# EAGLE design gsmSwitch_REV_C (EAGLE 5.07)

## Sheet 1 of 4
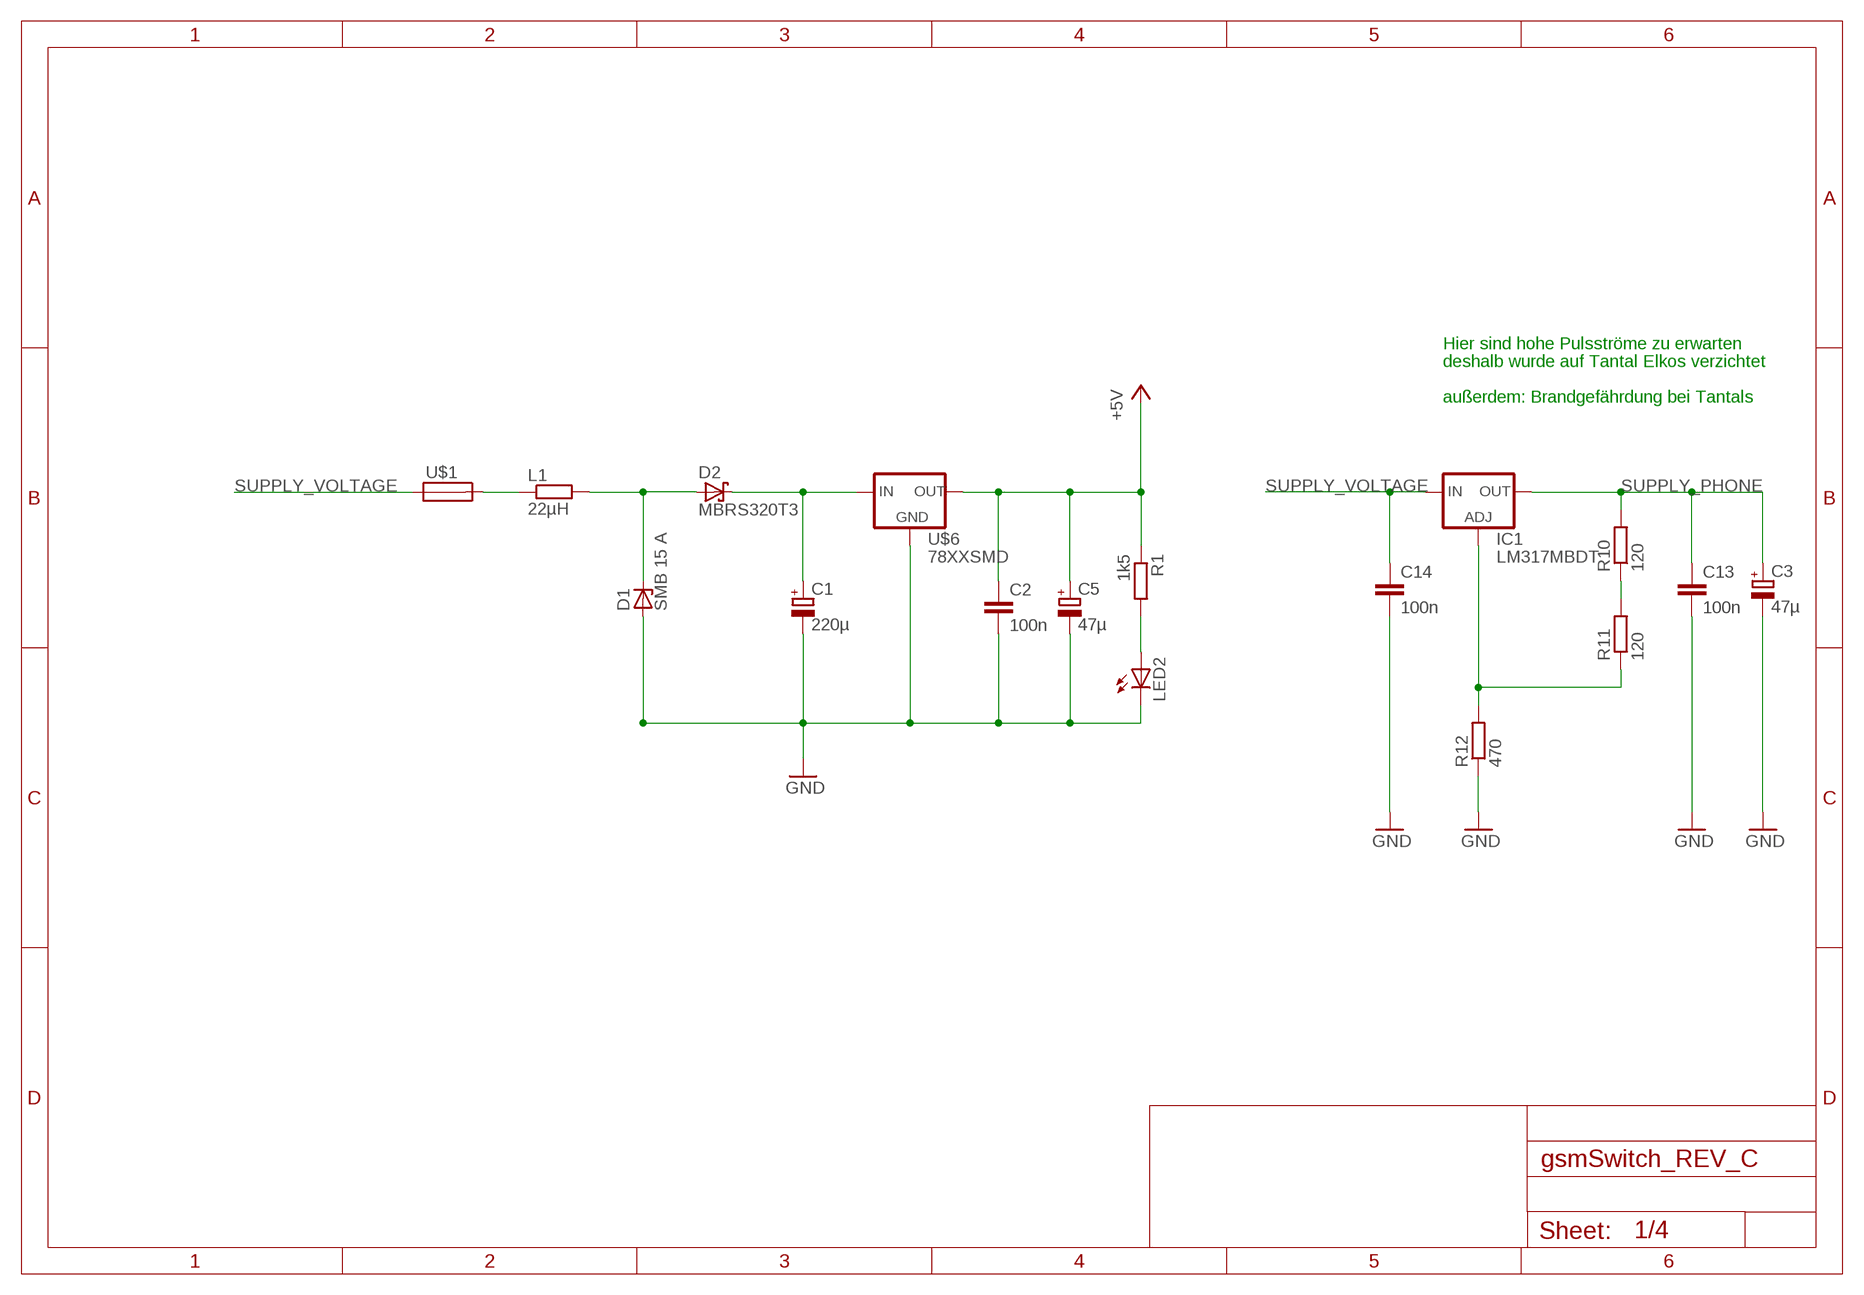
[diagram p0: schematic, sheet 1]

### Parts
C1  220µ  CPOL-EUE5-10.5  [E5-10,5]
C2  100n  C-EUC0603  [C0603]
C3  47µ  CPOL-EUE2-4  [E2-4]
C5  47µ  CPOL-EUE2-4  [E2-4]
C13  100n  C-EUC0603  [C0603]
C14  100n  C-EUC0603  [C0603]
D1  SMB 15 A  ZENER-DIODESMB  [SMB]
D2  MBRS320T3  [SMC]
IC1  LM317MBDT  [DPACK]
L1  22µH  R-EU_R1206  [R1206]
LED2  LEDCHIPLED_1206  [CHIPLED_1206]
R1  1k5  R-EU_R0603  [R0603]
R10  120  R-EU_R0603  [R0603]
R11  120  R-EU_R0603  [R0603]
R12  470  R-EU_R0603  [R0603]
U$1  TP-154  [TP-154]
U$6  78XXSMD  [DPACK]

### Nets
+5V: C2.1 C5.+ R1.1 U$6.3(OUT) ; also sheet 2,3,4
GND: C1.- C2.2 C3.- C5.- C13.2 C14.2 D1.A LED2.C R12.1 U$6.4(GND) ; also sheet 2,3,4
N$1: C1.+ D2.C U$6.1(IN)
N$6: IC1.1(ADJ) R11.1 R12.2
N$15: R10.1 R11.2
N$17: L1.1 U$1.P$3
N$23: D1.C D2.A L1.2
N$25: LED2.A R1.2
SUPPLY_PHONE: C3.+ C13.1 IC1.4(OUT) R10.2 ; also sheet 3
SUPPLY_VOLTAGE: C14.1 IC1.3(IN) U$1.P$2 ; also sheet 3

### Notes on the sheet
- Hier sind hohe Pulsströme zu erwarten
- deshalb wurde auf Tantal Elkos verzichtet
- außerdem: Brandgefährdung bei Tantals

## Sheet 2 of 4
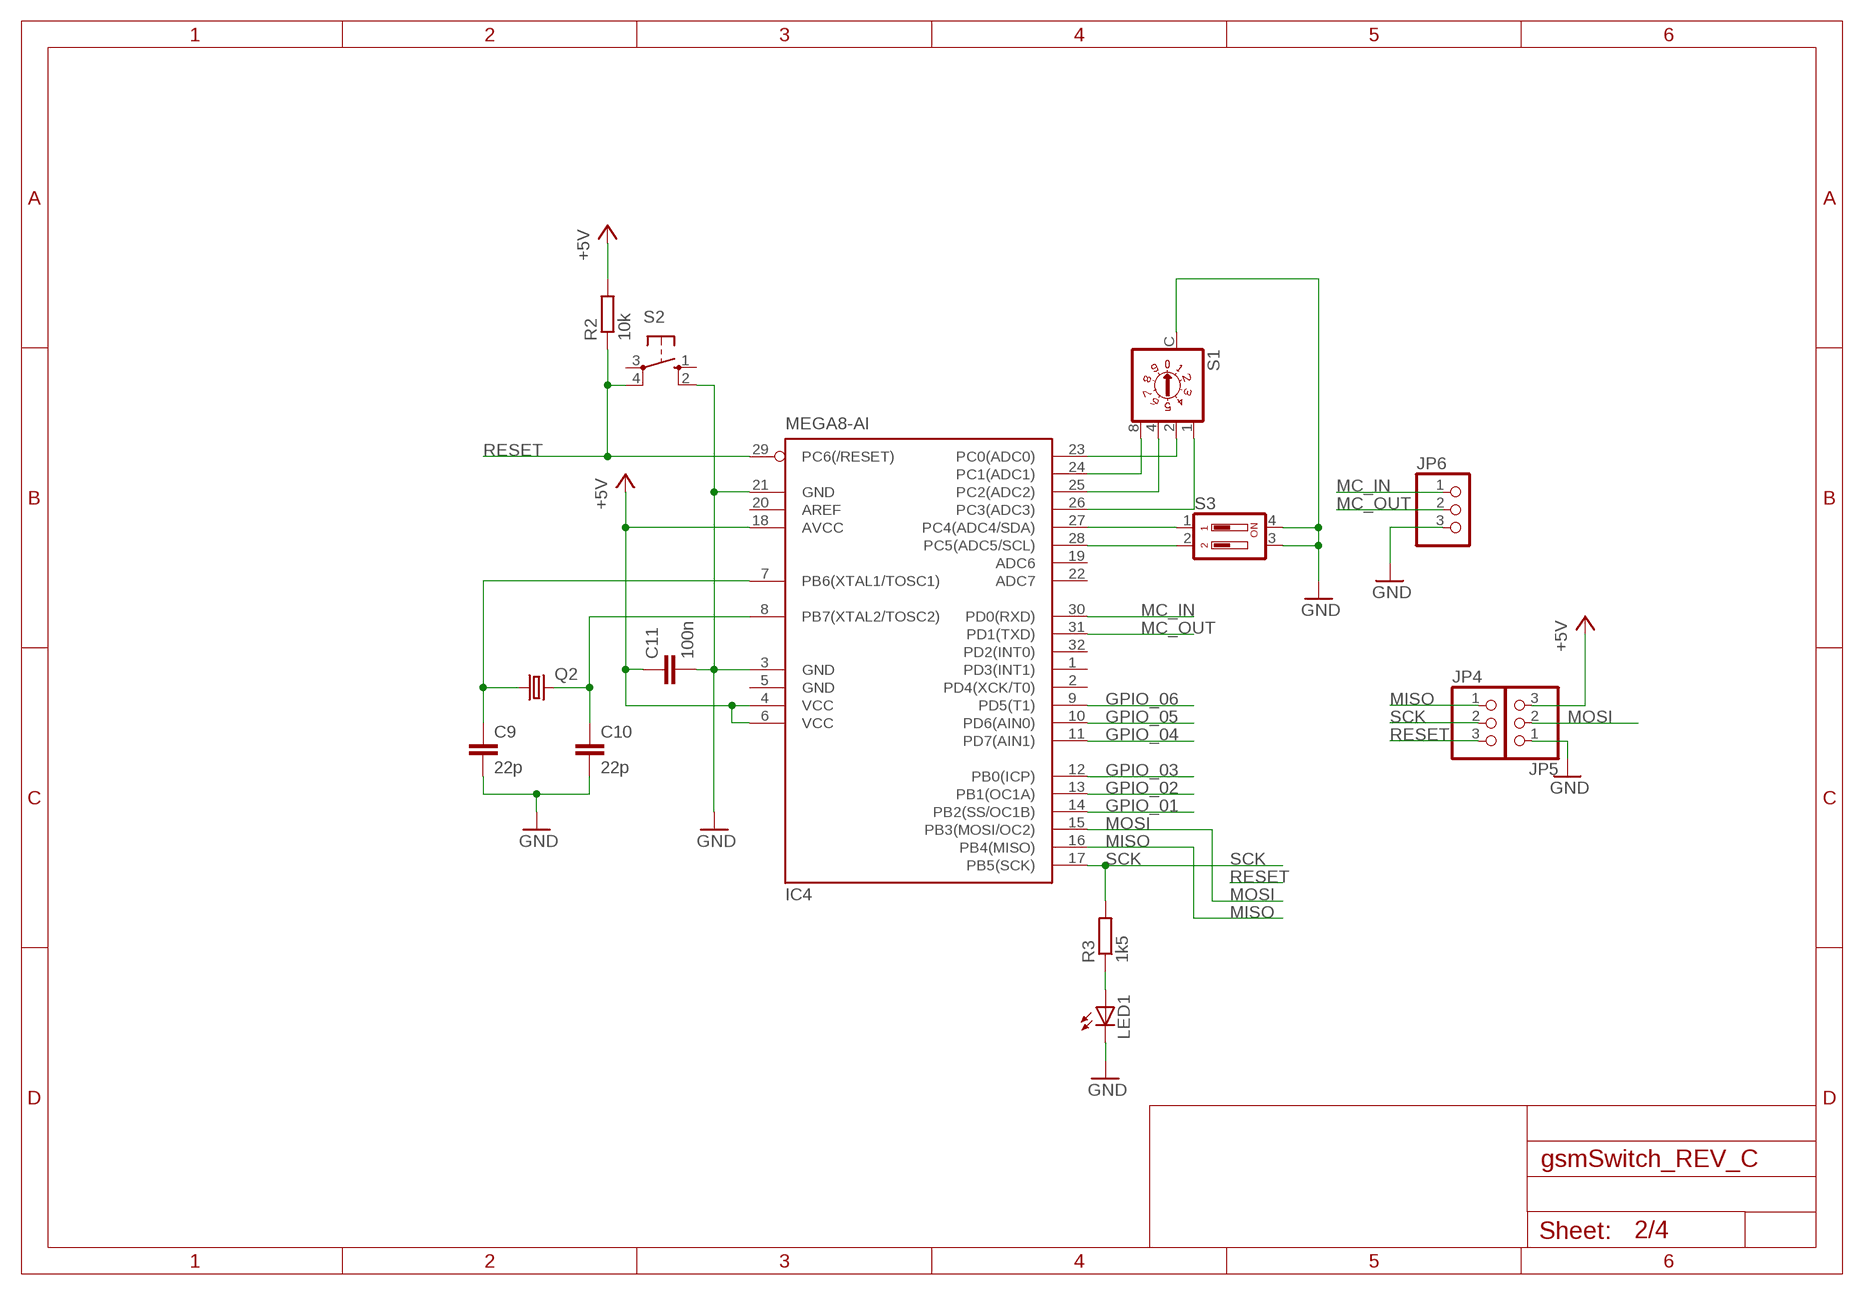
[diagram p1: schematic, sheet 2]

### Parts
C9  22p  C-EUC0603  [C0603]
C10  22p  C-EUC0603  [C0603]
C11  100n  C-EUC0603  [C0603]
IC4  MEGA8-AI  [TQFP32-08]
JP4  PINHD-1X03_2.54-SMD-90°  [1X03SMD/90]
JP5  PINHD-1X03_2.54-SMD-90°  [1X03SMD/90]
JP6  PINHD-1X3  [1X03]
LED1  LEDCHIPLED_1206  [CHIPLED_1206]
Q2  CRYSTALHC49UP  [HC49UP]
R2  10k  R-EU_R0603  [R0603]
R3  1k5  R-EU_R0603  [R0603]
S1  P101  [P101]
S2  10-XX  [B3F-10XX]
S3  DIP02YL  [DIP02YL]

### Nets
+5V: C11.1 IC4.4(VCC) IC4.6(VCC) IC4.18(AVCC) JP5.3 R2.2 ; also sheet 1,3,4
GND: C9.2 C10.2 C11.2 IC4.3(GND) IC4.21(GND) JP5.1 JP6.3 LED1.C S1.C S2.2(S1) S3.3 S3.4 ; also sheet 1,3,4
GPIO_01: IC4.14(PB2(SS/OC1B)) ; also sheet 3
GPIO_02: IC4.13(PB1(OC1A)) ; also sheet 3
GPIO_03: IC4.12(PB0(ICP)) ; also sheet 3
GPIO_04: IC4.11(PD7(AIN1)) ; also sheet 3
GPIO_05: IC4.10(PD6(AIN0)) ; also sheet 3
GPIO_06: IC4.9(PD5(T1)) ; also sheet 3
MC_IN: IC4.30(PD0(RXD)) JP6.1 ; also sheet 4
MC_OUT: IC4.31(PD1(TXD)) JP6.2 ; also sheet 4
MISO: IC4.16(PB4(MISO)) JP4.1
MOSI: IC4.15(PB3(MOSI/OC2)) JP5.2
N$8: IC4.27(PC4(ADC4/SDA)) S3.1
N$11: IC4.28(PC5(ADC5/SCL)) S3.2
N$34: LED1.A R3.1
N$41: C9.1 IC4.7(PB6(XTAL1/TOSC1)) Q2.1
N$44: C10.1 IC4.8(PB7(XTAL2/TOSC2)) Q2.2
N$45: IC4.23(PC0(ADC0)) S1.2
N$46: IC4.24(PC1(ADC1)) S1.8
N$47: IC4.25(PC2(ADC2)) S1.4
N$48: IC4.26(PC3(ADC3)) S1.1
RESET: IC4.29(PC6(/RESET)) JP4.3 R2.1 S2.4(P1)
SCK: IC4.17(PB5(SCK)) JP4.2 R3.2
Unconnected: IC4.1(PD3(INT1)) IC4.2(PD4(XCK/T0)) IC4.19(ADC6) IC4.20(AREF) IC4.22(ADC7) IC4.32(PD2(INT0)) S2.1(S) S2.3(P)

## Sheet 3 of 4
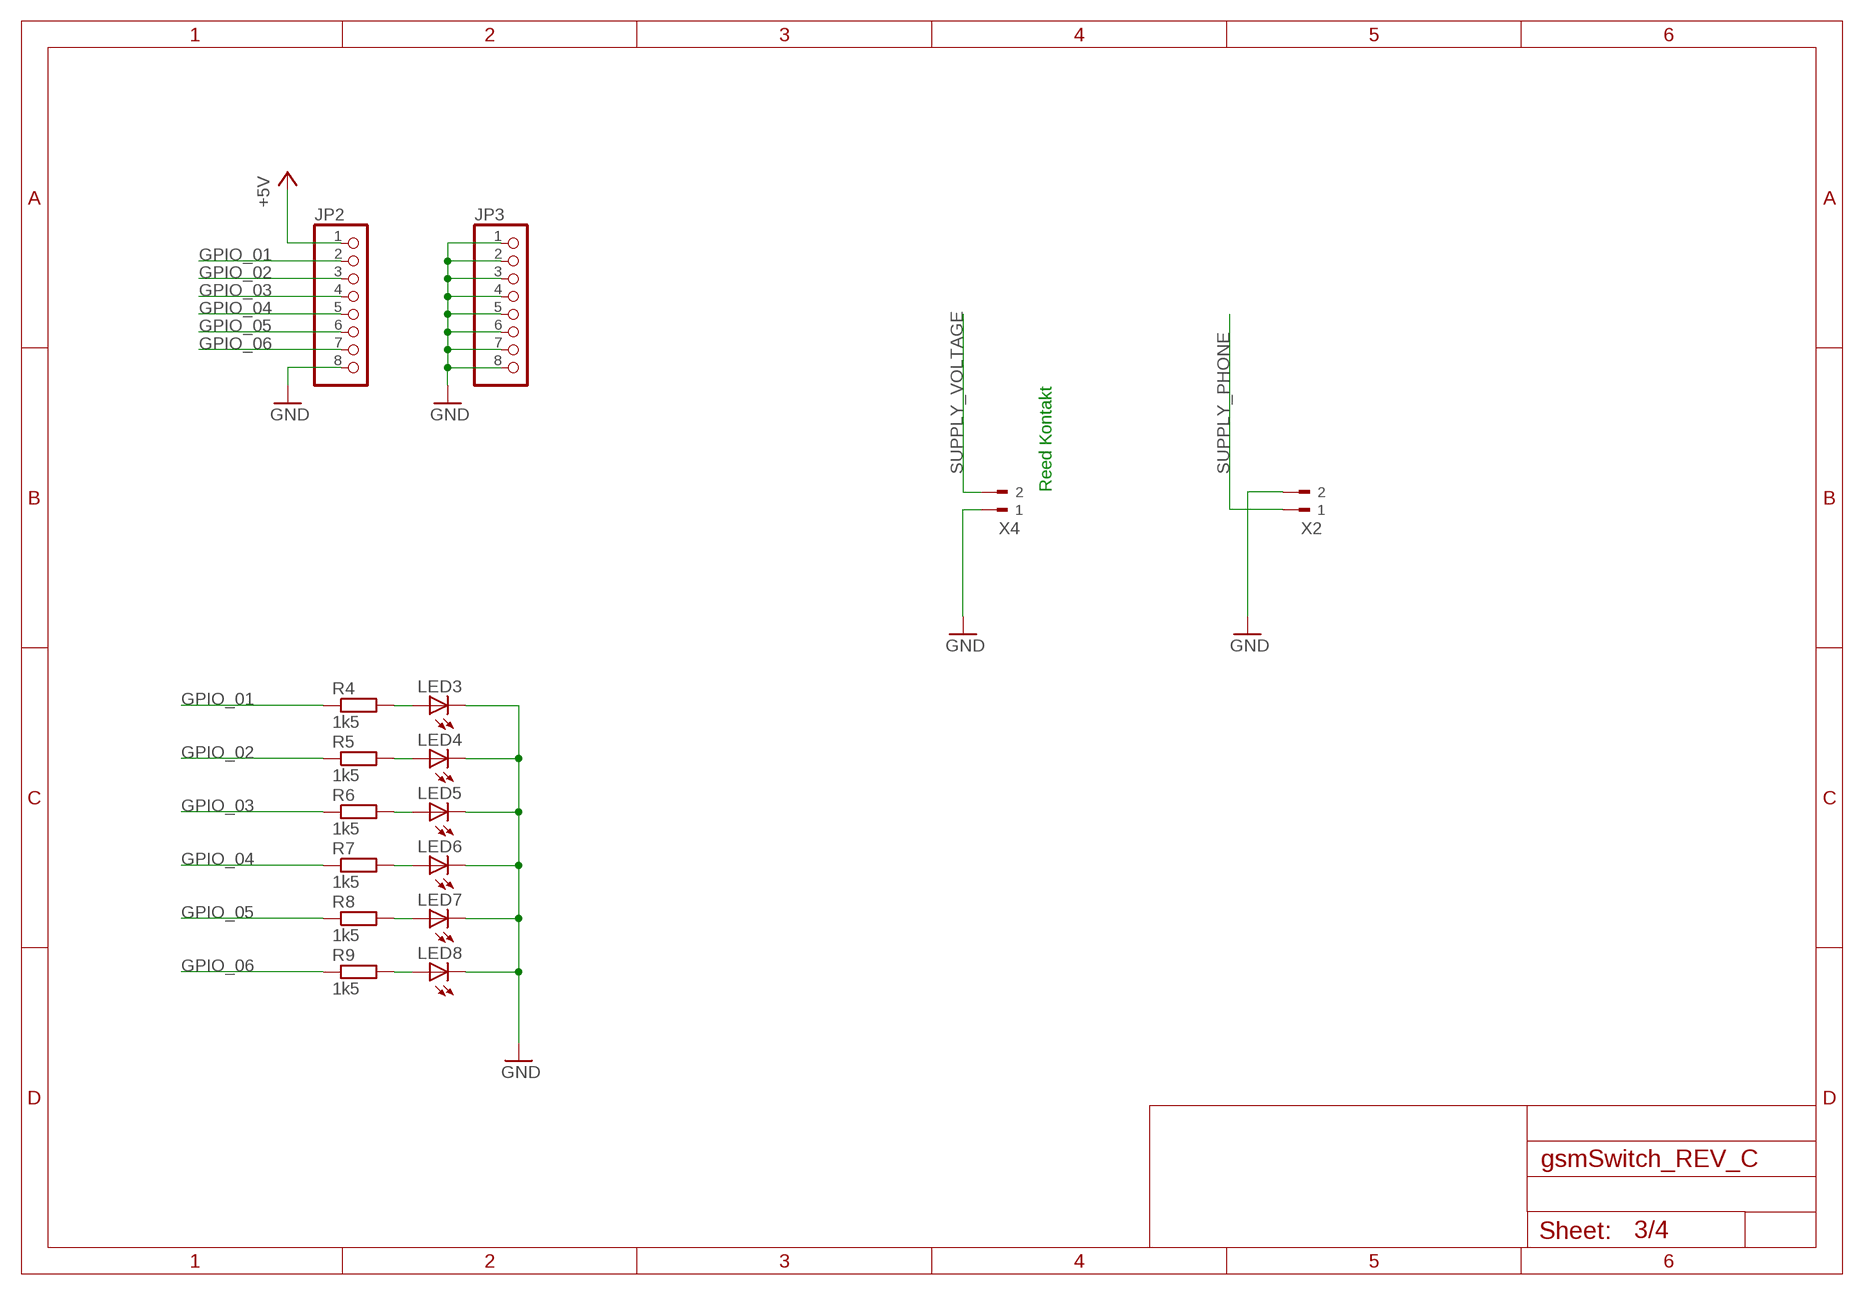
[diagram p2: schematic, sheet 3]

### Parts
JP2  PINHD-1X08_2.54-SMD-90°  [1X08SMD/90]
JP3  PINHD-1X08_2.54-SMD-90°  [1X08SMD/90]
LED3  LEDCHIP-LED0603  [CHIP-LED0603]
LED4  LEDCHIP-LED0603  [CHIP-LED0603]
LED5  LEDCHIP-LED0603  [CHIP-LED0603]
LED6  LEDCHIP-LED0603  [CHIP-LED0603]
LED7  LEDCHIP-LED0603  [CHIP-LED0603]
LED8  LEDCHIP-LED0603  [CHIP-LED0603]
R4  1k5  R-EU_R0603  [R0603]
R5  1k5  R-EU_R0603  [R0603]
R6  1k5  R-EU_R0603  [R0603]
R7  1k5  R-EU_R0603  [R0603]
R8  1k5  R-EU_R0603  [R0603]
R9  1k5  R-EU_R0603  [R0603]
X2  180-2  [180-2]
X4  180-2  [180-2]

### Nets
+5V: JP2.1 ; also sheet 1,2,4
GND: JP2.8 JP3.1 JP3.2 JP3.3 JP3.4 JP3.5 JP3.6 JP3.7 JP3.8 LED3.C LED4.C LED5.C LED6.C LED7.C LED8.C X2.2 X4.1 ; also sheet 1,2,4
GPIO_01: JP2.2 R4.1 ; also sheet 2
GPIO_02: JP2.3 R5.1 ; also sheet 2
GPIO_03: JP2.4 R6.1 ; also sheet 2
GPIO_04: JP2.5 R7.1 ; also sheet 2
GPIO_05: JP2.6 R8.1 ; also sheet 2
GPIO_06: JP2.7 R9.1 ; also sheet 2
N$2: LED8.A R9.2
N$3: LED7.A R8.2
N$4: LED6.A R7.2
N$5: LED5.A R6.2
N$7: LED4.A R5.2
N$9: LED3.A R4.2
SUPPLY_PHONE: X2.1 ; also sheet 1
SUPPLY_VOLTAGE: X4.2 ; also sheet 1

### Notes on the sheet
- Reed Kontakt

## Sheet 4 of 4
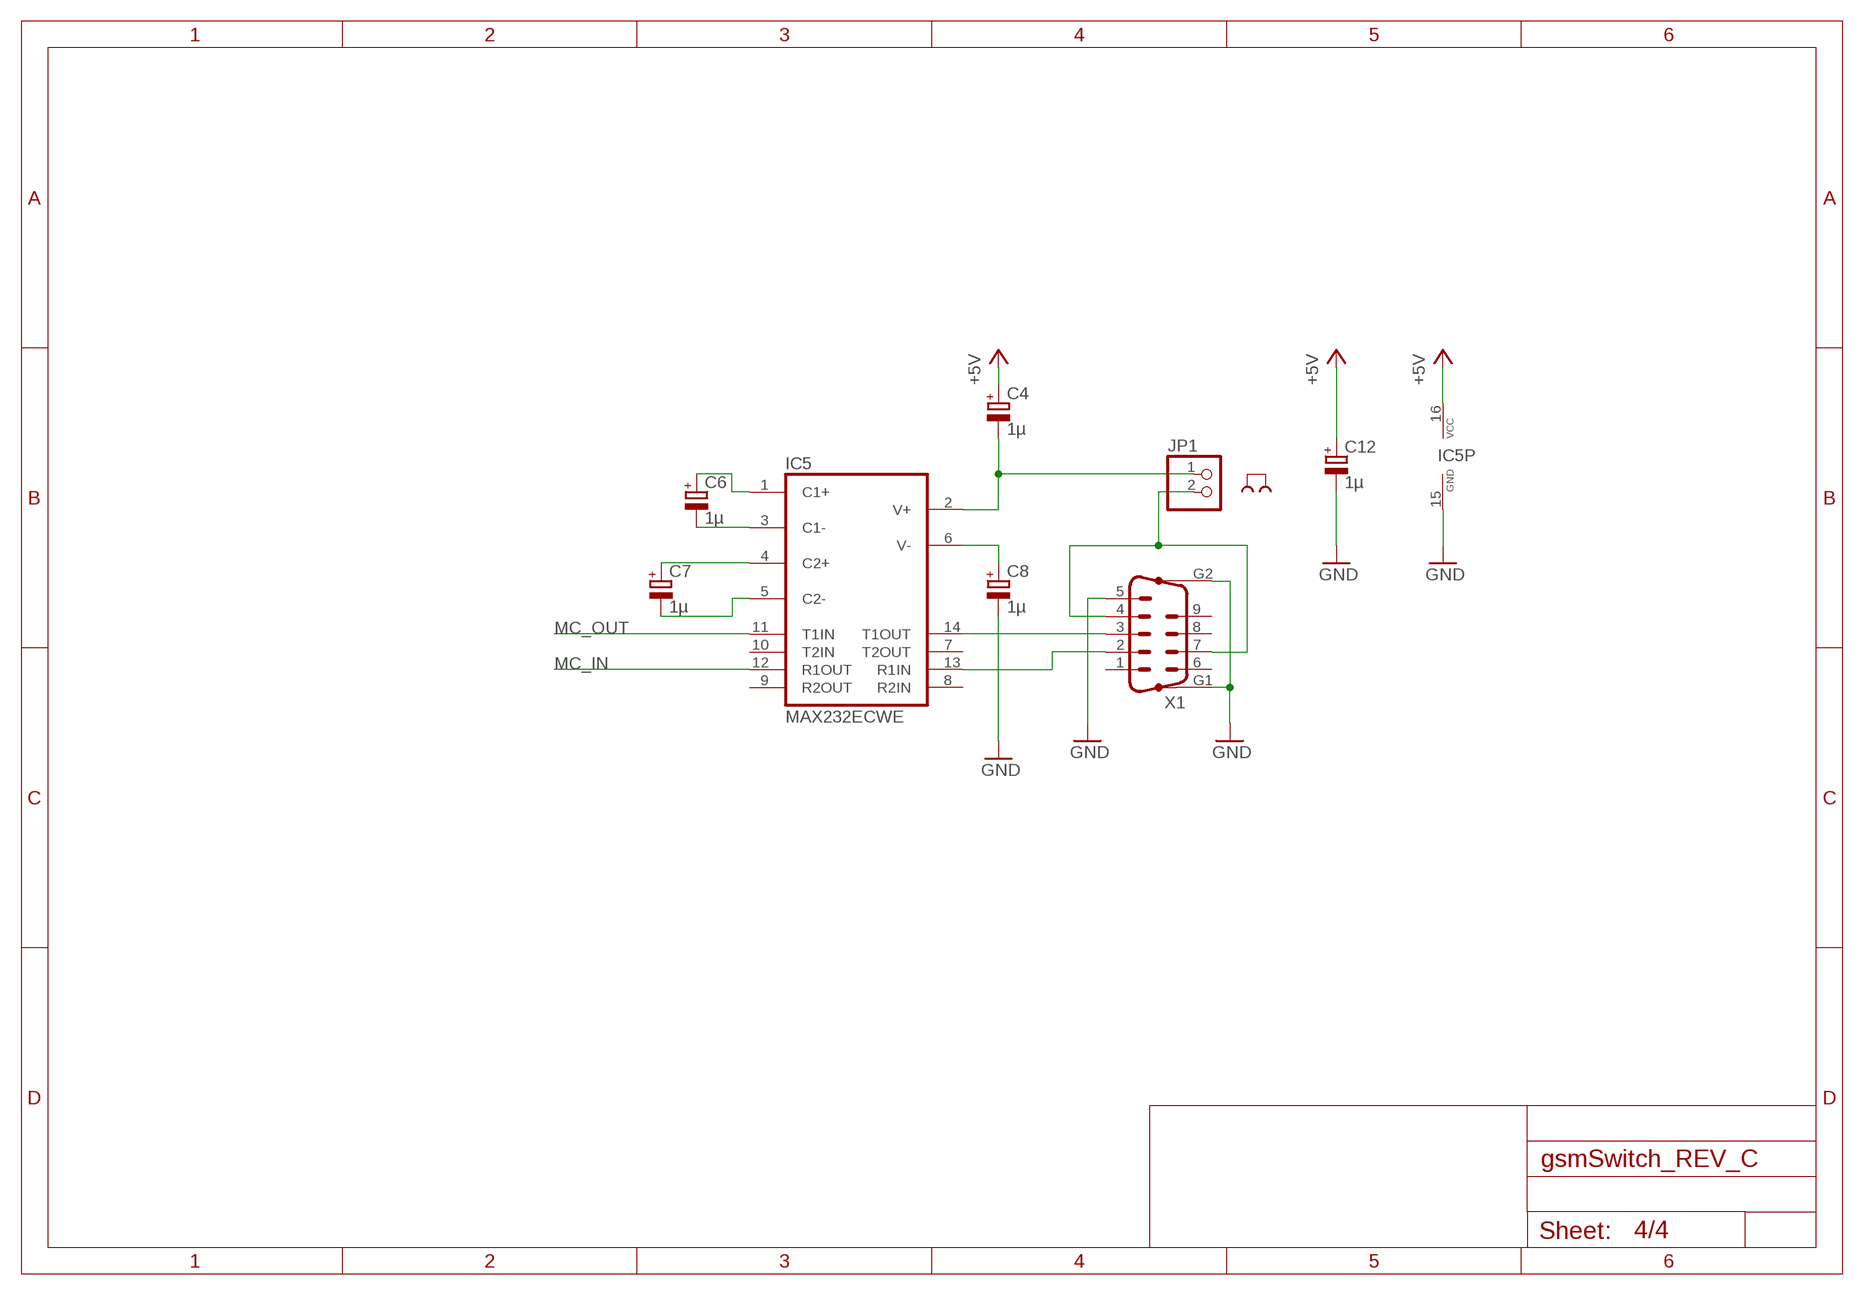
[diagram p3: schematic, sheet 4]

### Parts
C4  1µ  CPOL-EUSANYO_SMD_A5  [SANYO-OSCON_SMD_A5]
C6  1µ  CPOL-EUSANYO_SMD_A5  [SANYO-OSCON_SMD_A5]
C7  1µ  CPOL-EUSANYO_SMD_A5  [SANYO-OSCON_SMD_A5]
C8  1µ  CPOL-EUSANYO_SMD_A5  [SANYO-OSCON_SMD_A5]
C12  1µ  CPOL-EUSANYO_SMD_A5  [SANYO-OSCON_SMD_A5]
IC5  MAX232ECWE  [SO16L]
J1  JUMPER  [JUMP]
JP1  PINHD-1X2  [1X02]
X1  M09HP  [M09HP]

### Nets
+5V: C4.+ C12.+ IC5.16(VCC) ; also sheet 1,2,3
GND: C8.- C12.- IC5.15(GND) X1.5 X1.G1 X1.G2 ; also sheet 1,2,3
MC_IN: IC5.12(R1OUT) ; also sheet 2
MC_OUT: IC5.11(T1IN) ; also sheet 2
N$10: IC5.13(R1IN) X1.2
N$12: IC5.14(T1OUT) X1.3
N$13: JP1.2 X1.4 X1.7
N$16: C8.+ IC5.6(V-)
N$18: C6.+ IC5.1(C1+)
N$19: C6.- IC5.3(C1-)
N$20: C7.+ IC5.4(C2+)
N$21: C7.- IC5.5(C2-)
N$22: C4.- IC5.2(V+) JP1.1
Unconnected: IC5.7(T2OUT) IC5.8(R2IN) IC5.9(R2OUT) IC5.10(T2IN) X1.1 X1.6 X1.8 X1.9

## Power pins joined to a net without a drawn wire
GND: IC4.5(GND)

## Library data of the parts
C1 C3-C8 C12 = rcl:CPOL-EU: POLARIZED CAPACITOR, European symbol
C2 C9-C11 C13 C14 = rcl:C-EU: CAPACITOR, European symbol
D1 = diode:ZENER-DIODE: Z-Diode
D2 = diode:MBRS3*0T3: SCHOTTKY BARRIER RECTIFIER 3.0 AMPERES 20, 30, 40 VOLT Source: MBRS340T3-D.pdf
IC1 = v-reg:LM317?*: 500 mA Adjustable Output Positive Voltage Regulator Source: http://www.onsemi.co.jp .. LM317M-D.PDF
IC4 = atmel:MEGA8: MICROCONTROLLER 8 Kbytes FLASH, 1 kbytes SRAM, 512 bytes EEPROM, USART, 6-channel 10 bit ADC, 2-channel 8 bit ADC Pin compatible with Atmega48, ATMega88, ATMega168 Source: avr.lbr
IC5 = maxim-6a:MAX232ECWE: RS232 TRANSEIVER
J1 = jumper:JUMPER: JUMPER header
JP1 = pinhead:PINHD-1X2: PIN HEADER
JP2 JP3 = pinhead-2:PINHD-1X08: PIN HEADER
JP4 JP5 = pinhead-2:PINHD-1X03: PIN HEADER
JP6 = pinhead:PINHD-1X3: PIN HEADER
L1 R1-R12 = rcl:R-EU_: RESISTOR, European symbol
LED1-LED8 = led:LED: LED OSRAM: - CHIPLED LG R971, LG N971, LY N971, LG Q971, LY Q971, LO R971, LY R971 LH N974, LH R974 LS Q976, LO Q976, LY Q976 LO Q996 - Hyper CHIPLED LW Q18S LB Q993, LB Q99A, LB R99A - SideLED LS A670, LO A670, LY A670, LG A670, LP A670 LB A673, LV A673, LT A673, LW A673 LH A674 LY A675 LS A676, LA A676, LO A676, LY A676, LW A676 LS A679, LY A679, LG A679 - Hyper Micro SIDELED® LS Y876, LA Y876, LO Y876, LY Y876 LT Y87S - SmartLED LW L88C, LW L88S LB L89C, LB L89S, LG L890 LS L89K, LO L89K, LY L89K LS L896, LA L896, LO L896, LY L896 - TOPLED LS T670, LO T670, LY T670, LG T670, LP T670 LSG T670, LSP T670, LSY T670, LOP T670, LYG T670 LG T671, LOG T671, LSG T671 LB T673, LV T673, LT T673, LW T673 LH T674 LS T676, LA T676, LO T676, LY T676, LB T676, LH T676, LSB T676, LW T676 LB T67C, LV T67C, LT T67C, LS T67K, LO T67K, LY T67K, LW E67C LS E67B, LA E67B, LO E67B, LY E67B, LB E67C, LV E67C, LT E67C LW T67C LS T679, LY T679, LG T679 LS T770, LO T770, LY T770, LG T770, LP T770 LB T773, LV T773, LT T773, LW T773 LH T774 LS E675, LA E675, LY E675, LS T675 LS T776, LA T776, LO T776, LY T776, LB T776 LHGB T686 LT T68C, LB T68C - Hyper Mini TOPLED® LB M676 - Mini TOPLED Santana® LG M470 LS M47K, LO M47K, LY M47K Source: http://www.osram.convergy.de LUXEON: - LUMILED® LXK2-PW12-R00, LXK2-PW12-S00, LXK2-PW14-U00, LXK2-PW14-V00 LXK2-PM12-R00, LXK2-PM12-S00, LXK2-PM14-U00 LXK2-PE12-Q00, LXK2-PE12-R00, LXK2-PE12-S00, LXK2-PE14-T00, LXK2-PE14-U00 LXK2-PB12-K00, LXK2-PB12-L00, LXK2-PB12-M00, LXK2-PB14-N00, LXK2-PB14-P00, LXK2-PB14-Q00 LXK2-PR12-L00, LXK2-PR12-M00, LXK2-PR14-Q00, LXK2-PR14-R00 LXK2-PD12-Q00, LXK2-PD12-R00, LXK2-PD12-S00 LXK2-PH12-R00, LXK2-PH12-S00 LXK2-PL12-P00, LXK2-PL12-Q00, LXK2-PL12-R00 Source: www.luxeon.com KINGBRIGHT: KA-3528ASYC Source: www.kingbright.com
Q2 = crystal:CRYSTAL: CRYSTAL
S1 = switch-dil:P101: DIL/CODE SWITCH
S2 = switch-omron:10-XX: OMRON SWITCH
S3 = switch-dil:DIP02YL: DIL/CODE SWITCH
U$1 = keystone_advanced:TP-154
U$6 = v-reg:78XXSMD
X1 = con-subd:M09HP: SUB-D
X2 X4 = con-weidmueller-sl35:180-2: WEIDMUELLER CLAMP CONNECTOR

## Board
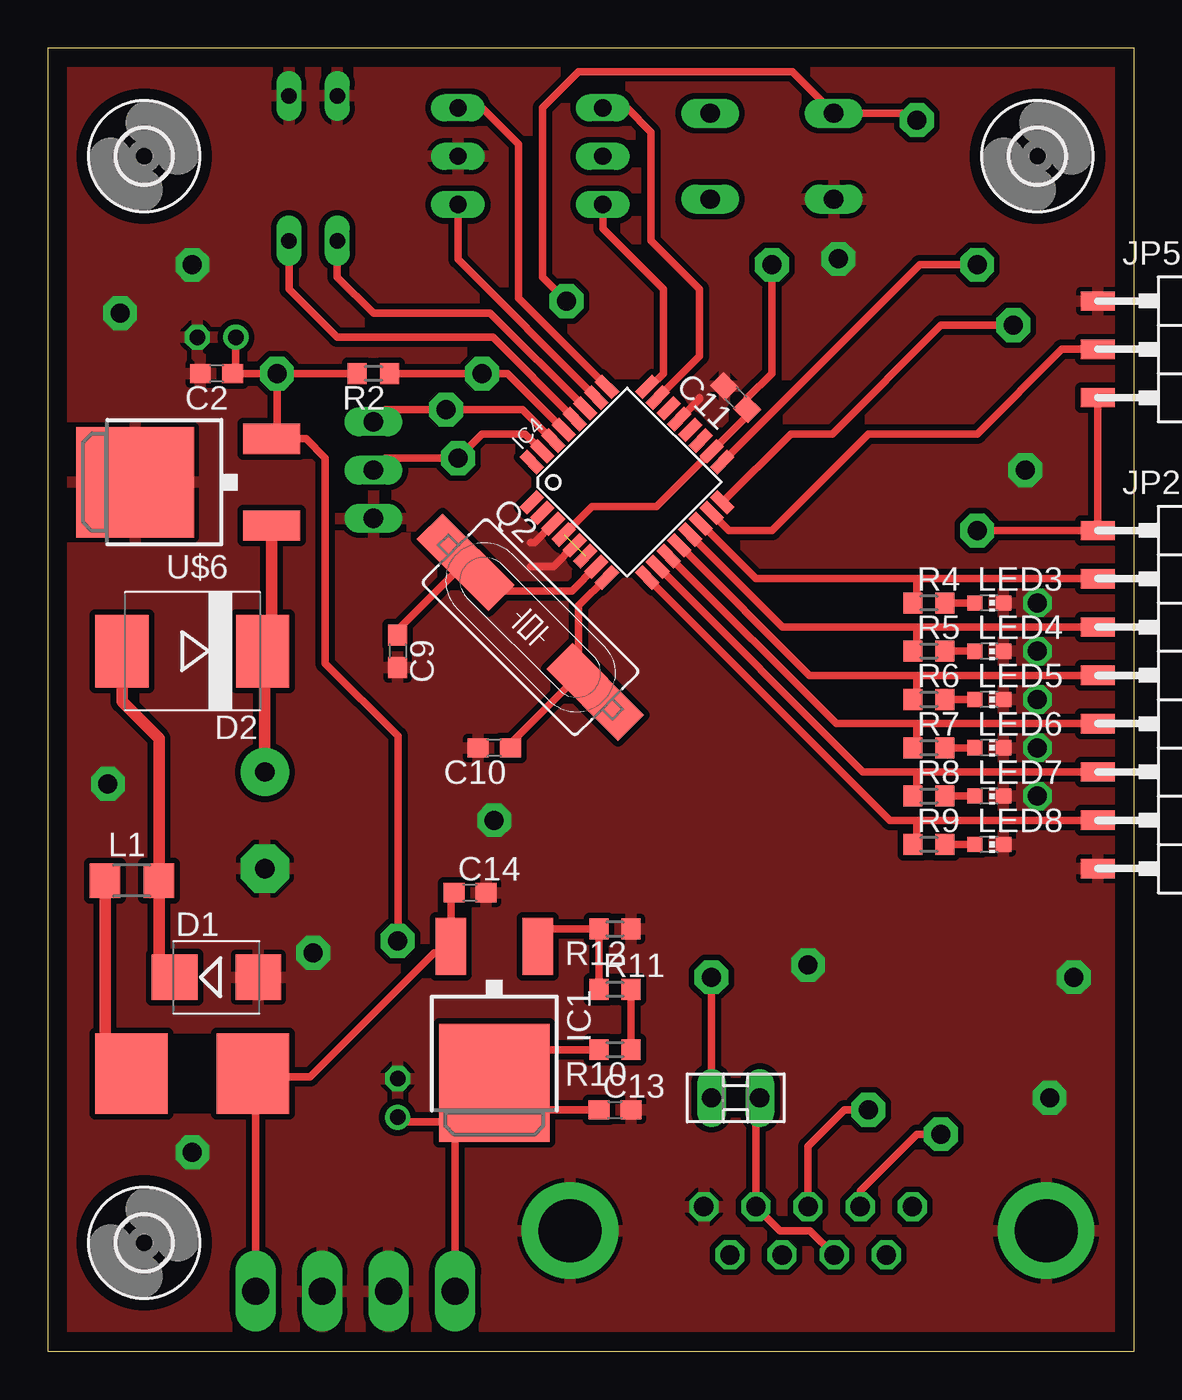
[diagram p4: board, top side]
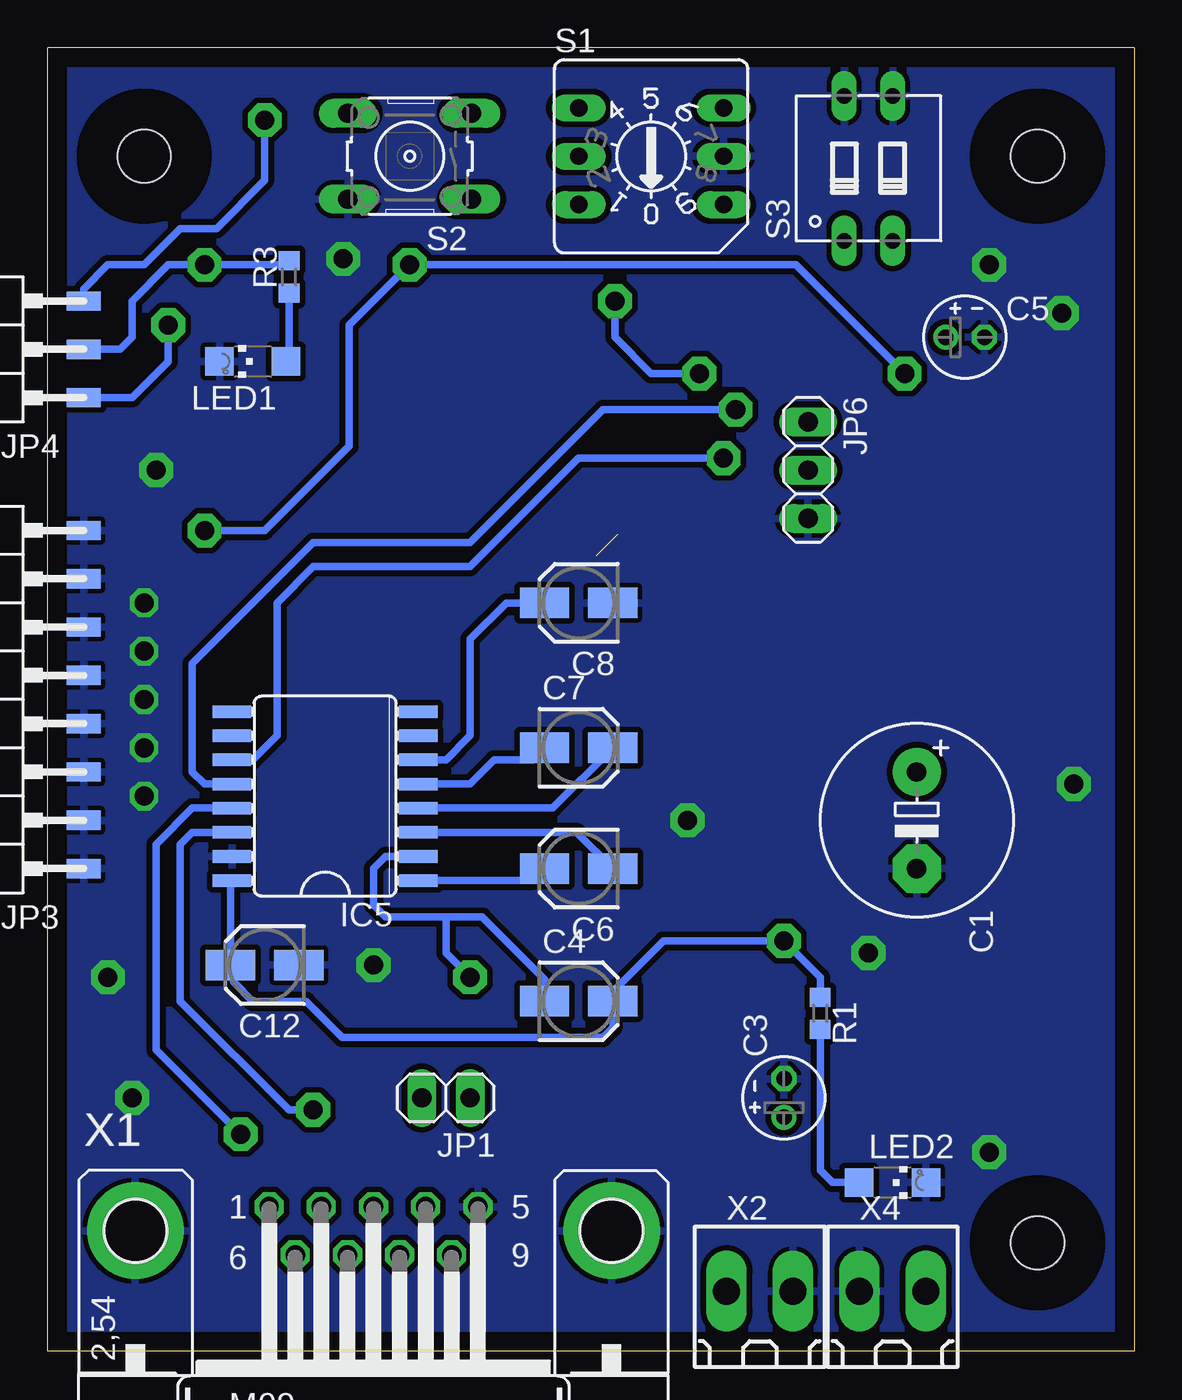
[diagram p5: board, bottom side, seen from below]

Size 57.15 x 68.58 mm. Coordinates in mm from the lower left corner, seen from the top.
Outline: 0,68.58 0,0 57.15,0 57.15,68.58 0,68.58
Copper layers (1*16): Top 0.035mm / dielectric 1.5mm / Bottom 0.035mm
Design rules "default *": minimum track width 10mil, minimum drill 24mil, track to track 12mil, track to pad 12mil, pad to pad 12mil, via to via 12mil, smd to smd 12mil, copper to edge 40mil, drill to drill 8mil, minimum pad ring 10mil, minimum via ring 8mil, stop-mask expansion 4mil, vias tented up to drill 0mil, thermal gap 10mil
tRestrict: area 6.3,12.7 to 8.9,16.5

### Footprints (pad centres in the part's own frame; a part is rotated, then mirrored left to right if it is on the bottom)
E5-10,5 = drill 1.016 pad 2.54 round: + -2.54,0 | drill 1.016 pad 2.54 octagon: - 2.54,0
C0603 = smd 1.1 x 1: 1 -0.85,0; 2 0.85,0
E2-4 = drill 0.813 pad 1.27 round: + -1.016,0 | drill 0.813 pad 1.27 octagon: - 1.016,0
SANYO-OSCON_SMD_A5 = smd 2.6 x 1.6: + 1.8,0; - -1.8,0
SMB = smd 2.4 x 2.4: A 2.2,0; C -2.2,0
SMC = smd 2.8 x 3.8: A 3.7,0; C -3.7,0
DPACK = smd 1.6 x 3: 1 -2.28,-4.8; 3 2.28,-4.8 | smd 5.8 x 6.2: 4 0,2.38
TQFP32-08 = smd 1.27 x 0.559: 1 -4.293,2.8; 2 -4.293,2; 3 -4.293,1.2; 4 -4.293,0.4; 5 -4.293,-0.4; 6 -4.293,-1.2; 7 -4.293,-2; 8 -4.293,-2.8; 17 4.293,-2.8; 18 4.293,-2; 19 4.293,-1.2; 20 4.293,-0.4; 21 4.293,0.4; 22 4.293,1.2; 23 4.293,2; 24 4.293,2.8 | smd 0.559 x 1.27: 9 -2.8,-4.293; 10 -2,-4.293; 11 -1.2,-4.293; 12 -0.4,-4.293; 13 0.4,-4.293; 14 1.2,-4.293; 15 2,-4.293; 16 2.8,-4.293; 25 2.8,4.293; 26 2,4.293; 27 1.2,4.293; 28 0.4,4.293; 29 -0.4,4.293; 30 -1.2,4.293; 31 -2,4.293; 32 -2.8,4.293
SO16L = smd 0.66 x 2.032: 1 -4.445,-4.902; 2 -3.175,-4.902; 3 -1.905,-4.902; 4 -0.635,-4.902; 5 0.635,-4.902; 6 1.905,-4.902; 7 3.175,-4.902; 8 4.445,-4.902; 9 4.445,4.902; 10 3.175,4.902; 11 1.905,4.902; 12 0.635,4.902; 13 -0.635,4.902; 14 -1.905,4.902; 15 -3.175,4.902; 16 -4.445,4.902
1X02 = drill 1.016 long: 1 -1.27,0; 2 1.27,0
1X08SMD/90 = smd 1.016 x 1.778: 1 -1.27,-5.08; 2 1.27,-5.08; 3 3.81,-5.08; 4 6.35,-5.08; 5 8.89,-5.08; 6 11.43,-5.08; 7 13.97,-5.08; 8 16.51,-5.08
1X03SMD/90 = smd 1.016 x 1.778: 1 -1.27,-5.08; 2 1.27,-5.08; 3 3.81,-5.08
1X03 = drill 1.016 long: 1 -2.54,0; 2 0,0; 3 2.54,0
R1206 = smd 1.6 x 1.803: 1 -1.422,0; 2 1.422,0
CHIPLED_1206 = smd 1.5 x 1.5: A 0,-1.75; C 0,1.75
CHIP-LED0603 = smd 0.8 x 0.8: A 0,-0.75; C 0,0.75
HC49UP = smd 5.334 x 1.93: 1 -4.826,0; 2 4.826,0
R0603 = smd 1 x 1.1: 1 -0.85,0; 2 0.85,0
P101 = drill 0.914 long: 1 3.81,-2.54; 2 -3.81,2.54; 4 3.81,2.54; 8 -3.81,-2.54; C 3.81,0; C1 -3.81,0
B3F-10XX = drill 1.016 long: 1 -3.251,2.261; 2 3.251,2.261; 3 -3.251,-2.261; 4 3.251,-2.261
DIP02YL = drill 0.813 long: 1 -1.27,-3.81; 2 1.27,-3.81; 3 1.27,3.81; 4 -1.27,3.81
TP-154 = smd 3.81 x 4.24: P$2 0,0; P$3 6.38,0
2,8 = hole 2.8: 0,0
M09HP = drill 1.016 octagon: 1 -5.486,1.27; 2 -2.743,1.27; 3 0,1.27; 4 2.743,1.27; 5 5.486,1.27; 6 -4.115,-1.27; 7 -1.372,-1.27; 8 1.372,-1.27; 9 4.115,-1.27 | drill 3.302 pad 5.08 round: G1 -12.522,0; G2 12.522,0
180-2 = drill 1.422 long: 1 -1.75,0; 2 1.75,0

### Placement (x,y rotation side)
C1  11.43,27.94 270 bottom
C2  8.89,51.44 180 top
C3  18.41,13.34 90 bottom
C4  29.21,18.41 0 bottom
C5  8.89,53.34 0 bottom
C6  29.21,25.4 180 bottom
C7  29.21,31.75 0 bottom
C8  29.21,39.37 180 bottom
C9  18.41,36.83 270 top
C10  23.5,31.75 180 top
C11  36.2,50.16 135 top
C12  45.72,20.32 180 bottom
C13  29.84,12.7 0 top
C14  22.23,24.13 0 top
D1  8.89,19.68 0 top
D2  7.62,36.83 180 top
IC1  23.5,16.51 180 top
IC4  30.48,45.72 45 top
IC5  42.55,29.21 90 bottom
J1  36.2,13.34 90 top
JP1  36.2,13.34 180 bottom
JP2  60.33,41.91 270 top
JP3  60.33,26.67 90 bottom
JP4  60.33,51.44 90 bottom
JP5  60.33,53.98 270 top
JP6  17.14,46.35 270 bottom
L1  4.45,24.77 0 top
LED1  46.35,52.07 90 bottom
LED2  12.7,8.89 270 bottom
LED3  49.53,39.37 270 top
LED4  49.53,36.83 270 top
LED5  49.53,34.29 270 top
LED6  49.53,31.75 270 top
LED7  49.53,29.21 270 top
LED8  49.53,26.67 270 top
Q2  25.4,38.1 315 top
R1  16.51,17.78 270 bottom
R2  17.14,51.44 180 top
R3  44.45,56.52 90 bottom
R4  46.35,39.37 0 top
R5  46.35,36.83 0 top
R6  46.35,34.29 0 top
R7  46.35,31.75 0 top
R8  46.35,29.21 0 top
R9  46.35,26.67 0 top
R10  29.84,15.88 180 top
R11  29.84,19.05 0 top
R12  29.84,22.23 180 top
S1  25.4,62.87 0 bottom
S2  38.1,62.87 180 bottom
S3  13.97,62.23 0 bottom
U$1  10.79,14.61 180 top
U$2  [2,8]  5.08,62.87 0 top
U$3  [2,8]  5.08,5.71 0 top
U$4  [2,8]  52.07,62.87 0 top
U$6  6.99,45.72 90 top
X1  40.01,6.35 0 bottom
X2  19.68,3.17 0 bottom
X4  12.7,3.17 0 bottom

### Tracks (layer width: path | path; a pad name or v marks a point on that pad's centre or on a via)
+5V  (via drill 1 pad 1.78)  (1 unrouted)
  Top 0.406: IC4.4 28.64,44.45 32.04,44.45 IC4.18 36.8,49.21 C11.1 36.8,50.13 38.1,51.44 v38.1,57.15 | v12.06,51.44 R2.2 | 12.04,48.26 U$6.3 12.06,48 | 12.06,48 v12.06,51.44 | 18.44,21.61 18.44,32.36 14.61,36.2 14.61,46.99 13.6,48 12.06,48 | v18.41,21.59 18.44,21.61 | 18.44,21.61 18.47,21.59 | v48.9,43.18 JP2.1 JP5.3 | v12.06,51.44 C2.1 9.91,51.44 C5.+
  Bottom 0.406: v12.06,51.44 17.78,57.15 v38.1,57.15 41.27,53.98 41.27,47.62 45.72,43.18 v48.9,43.18 | R1.1 16.51,19.68 v18.41,21.59 24.77,21.59 27.41,18.95 C4.+ 27.41,17.04 27.94,16.51 41.66,16.51 43.56,18.41 46.35,18.41 47.37,19.43 47.37,20.17 C12.+ 47.52,24.69 IC5.16
GND  (via drill 1 pad 1.42, 1 pad 1.78)
  Top 0.406: IC4.5 26.6,41.27 25.4,41.27 | IC4.21 34.29,50.1 34.29,50.16 | IC4.3 25.61,42.55 25.4,42.55
  other vias: 23.5,27.94 3.81,54.61 3.17,29.84 7.62,57.15 51.44,46.35 53.98,19.68 40.01,20.32 7.62,10.48 41.59,57.47 52.07,39.37 52.07,36.83 52.07,34.29 52.07,31.75 52.07,29.21 13.97,20.95 52.7,13.34
  pour Top: 71.75,71.75 71.75,-1.27 -3.81,-1.27 -3.81,71.75
  pour Bottom: 71.75,73.66 71.75,-1.27 -3.81,-1.27 -3.81,73.66
GPIO_01
  Top 0.406: 45.72,40.64 37.26,40.64 IC4.14 | 45.72,40.64 JP2.2 | R4.1 45.72,39.59 45.72,40.64
GPIO_02
  Top 0.406: 45.72,38.1 38.67,38.1 IC4.13 | 45.72,38.1 JP2.3 | R5.1 45.72,37.05 45.72,38.1
GPIO_03
  Top 0.406: 45.72,35.56 40.07,35.56 IC4.12 | 45.72,35.56 JP2.4 | R6.1 45.72,34.51 45.72,35.56
GPIO_04
  Top 0.406: 45.72,33.02 41.48,33.02 IC4.11 | 45.72,33.02 JP2.5 | R7.1 45.72,31.96 45.72,33.02
GPIO_05
  Top 0.406: 45.72,30.48 42.89,30.48 IC4.10 | 45.72,30.48 JP2.6 | R8.1 45.72,29.43 45.72,30.48
GPIO_06
  Top 0.406: 45.72,27.94 44.3,27.94 IC4.9 | 45.72,27.94 JP2.7 | R9.1 45.72,26.89 45.72,27.94
MC_IN  (via drill 1 pad 1.78)
  Top 0.406: IC4.30 24.97,49.53 v20.95,49.53 17.78,49.53 JP6.1
  Bottom 0.406: v20.95,49.53 27.94,49.53 34.92,42.55 43.18,42.55 49.53,36.2 49.53,30.48 48.9,29.84 IC5.12
MC_OUT  (via drill 1 pad 1.78)
  Top 0.406: IC4.31 25.11,48.26 22.86,48.26 v21.59,46.99 17.78,46.99 JP6.2
  Bottom 0.406: v21.59,46.99 29.21,46.99 34.92,41.27 43.18,41.27 45.09,39.37 45.09,32.38 46.35,31.11 IC5.11
MISO  (via drill 1 pad 1.78)
  Top 0.406: IC4.16 39.09,48.26 41.27,48.26 46.99,53.98 v50.8,53.98
  Bottom 0.406: v50.8,53.98 50.8,52.07 52.7,50.16 JP4.1
MOSI
  Top 0.406: IC4.15 35.85,43.18 38.1,43.18 43.18,48.26 48.9,48.26 53.34,52.7 JP5.2
N$1
  Top 0.61: C1.+ 11.43,36.72 D2.C 11.79,37.3 U$6.1
N$2
  Top 0.406: R9.2 LED8.A
N$3
  Top 0.406: R8.2 LED7.A
N$4
  Top 0.406: R7.2 LED6.A
N$5
  Top 0.406: R6.2 LED5.A
N$6
  Top 0.406: R11.1 R12.2 25.77,22.23 IC1.1 25.4,21.68
N$7
  Top 0.406: R5.2 LED4.A
N$8
  Top 0.406: IC4.27 23.29,54.61 17.14,54.61 15.24,56.52 S3.1
N$9
  Top 0.406: R4.2 LED3.A
N$10  (via drill 1 pad 1.78)
  Top 0.406: v46.99,11.43 45.72,11.43 42.75,8.46 X1.2
  Bottom 0.406: IC5.13 49.53,28.57 51.44,26.67 51.44,15.88 v46.99,11.43
N$11
  Top 0.406: IC4.28 23.43,53.34 15.24,53.34 12.7,55.88 S3.2
N$12  (via drill 1 pad 1.78)
  Top 0.406: v43.18,12.7 41.91,12.7 40.01,10.79 X1.3
  Bottom 0.406: IC5.14 49.53,27.3 50.16,26.67 50.16,18.41 44.45,12.7 v43.18,12.7
N$13
  Top 0.406: X1.7 40.11,6.35 38.53,6.35 X1.4 37.26,13.13 JP1.2
N$14
  pour Top: 26.67,66.04 27.3,65.41 31.75,65.41 32.38,64.77 32.38,51.44 26.67,51.44
N$15
  Top 0.406: R10.1 R11.2
N$16
  Bottom 0.406: IC5.6 36.2,31.11 34.92,32.38 34.92,37.47 33.02,39.37 C8.+
N$17
  Top 0.61: L1.1 3.02,15.36 U$1.P$3
  Top 0.813: U$1.P$3 3.02,14.61
N$18
  Bottom 0.406: IC5.1 31.64,24.77 C6.+
N$19
  Bottom 0.406: IC5.3 29.32,27.3 C6.-
N$20
  Bottom 0.406: IC5.4 30.59,28.57 C7.+
N$21
  Bottom 0.406: IC5.5 34.92,29.84 33.66,31.11 31.64,31.11 C7.-
N$22  (via drill 1 pad 1.78)
  Top 0.406: JP1.1 v34.92,19.68
  Bottom 0.406: IC5.2 39.37,26.04 40.01,25.4 40.01,23.5 39.37,22.86 36.2,22.86 | C4.- 31.01,19.58 34.29,22.86 36.2,22.86 | v34.92,19.68 36.2,20.95 36.2,22.86
N$23
  Top 0.61: D1.C 5.87,19.87 L1.2 5.87,32.23 3.92,34.18 D2.A
N$25
  Bottom 0.406: R1.2 16.51,9.53 15.88,8.89 LED2.A
N$34
  Bottom 0.406: R3.1 44.45,52.23 LED1.A
N$41
  Top 0.406: IC4.7 27.59,40.01 23.5,40.01 Q2.1 18.41,37.94 C9.1
N$44
  Top 0.406: IC4.8 27.94,39.22 27.94,35.56 | 27.94,35.56 Q2.2 | 27.94,35.56 24.34,31.96 C10.1
N$45
  Top 0.406: IC4.23 34.29,52.36 34.29,55.88 31.75,58.42 31.75,64.14 30.48,65.41 S1.2
N$46
  Top 0.406: IC4.24 31.68,50.73 32.38,51.44 32.38,55.88 29.21,59.05 S1.8
N$47
  Top 0.406: S1.4 22.86,65.41 24.77,63.5 24.77,55.4 IC4.25
N$48
  Top 0.406: IC4.26 21.59,57.44 S1.1
RESET  (via drill 1 pad 1.78)
  Top 0.406: IC4.29 24.2,51.44 v22.86,51.44 R2.1 | v27.3,55.24 26.04,56.52 26.04,65.41 27.94,67.31 39.17,67.31 S2.4 45.36,65.13 v45.72,64.77
  Bottom 0.406: v22.86,51.44 25.4,51.44 27.3,53.34 v27.3,55.24 | v45.72,64.77 45.72,61.59 48.26,59.05 50.16,59.05 52.07,57.15 53.98,57.15 55.24,55.88 JP4.3
SCK  (via drill 1 pad 1.78)
  Top 0.406: v48.9,57.15 45.87,57.15 IC4.17
  Bottom 0.406: JP4.2 53.34,52.7 52.7,53.34 52.7,55.24 50.8,57.15 v48.9,57.15 44.66,57.15 R3.2
SUPPLY_PHONE
  Top 0.406: 22.07,12.06 22.07,12.71 IC1.4 | R10.2 25.24,15.88 IC1.4 | C13.1 24.93,12.7 IC1.4 | 22.07,12.06 21.43,11.43 X2.1 | C3.+ 18.67,12.06 22.07,12.06
SUPPLY_VOLTAGE
  Top 0.406: X4.2 10.95,14.45 | 10.95,14.45 U$1.P$2 | 10.95,14.45 13.81,14.45 20.32,20.95 20.86,20.95 IC1.3 21.21,24.13 C14.1